# Altium schematic sheet Knee Control.SchDoc
size Letter; SheetNumber: 5; SheetTotal: 6
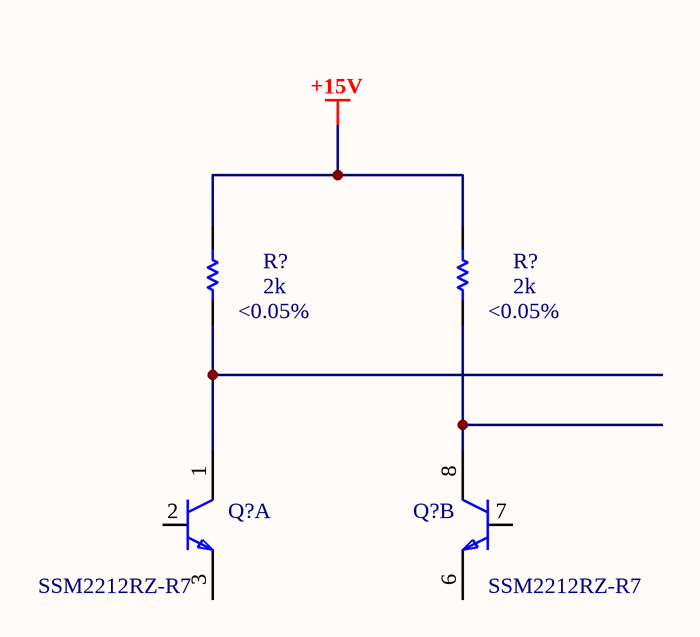
[diagram p0: Knee Control.SchDoc]

## Parts
(Parts that share a designator on the sheet are numbered #1, #2 ... from top to bottom, then left to right.)
Q?#1  SSM2212RZ-R7  [FP-R-8-IPC_B]  (part A of 3)
Q?#2  SSM2212RZ-R7  [FP-R-8-IPC_B]  (part B of 3)
R?#1  <0.05%  value 2k
R?#2  <0.05%  value 2k

## Nets
+15V: R?#1.2 R?#2.2
NetQ?#1_1: Q?#1.1(C1) R?#1.1
NetQ?#2_8: Q?#2.8(C2) R?#2.1

Not connected (* = marked no-connect by the designer): Q?#1 2(B1) 3(E1); Q?#2 6(E2) 7(B2)

## Library data of the parts
Q?#1 Q?#2 = SSM2212: TRANS 2NPN 40V 0.02A 8SOIC; Transition Frequency: 450MHz; Max Power Dissipation: 500mW; Element Configuration: Dual; Max Collector Current: 20mA; Polarity: NPN; Collector Emitter Breakdown Voltage: 45V; Number of Elements: 2; Collector-emitter Voltage-Max: 800mV; Frequency: 200MHz; Packaging: Tape and Reel; RoHS Compliant: Yes; Lead Free: Contains Lead; Contact Plating: Tin; Collector Emitter Voltage (VCEO): 40V; Max Breakdown Voltage: 40V; Case/Package: SOIC; Series: SSM2212; Radiation Hardening: No; Package Quantity: 1000; Number of Pins: 8; Collector Base Voltage (VCBO): 40V; Mount: Surface Mount; Max Operating Temperature: 85°C; Min Operating Temperature: -40°C
R?#1 R?#2 = Resistor: TC1: 0; SimulationGenericComponent: True; TC2: 0